# Altium schematic sheet Alimentacion_Sheet.SchDoc: Alimentacion
size 381 x 241 mm; Date: 13-10-2025; Author: Gerson T.& Lotfi D.; DrawnBy: NPI; Organization: Universidad Distrital Francisco José de Caldas; DocumentNumber: 2; Revision: 1.0; SheetNumber: 2; SheetTotal: 5; Time: 13:44
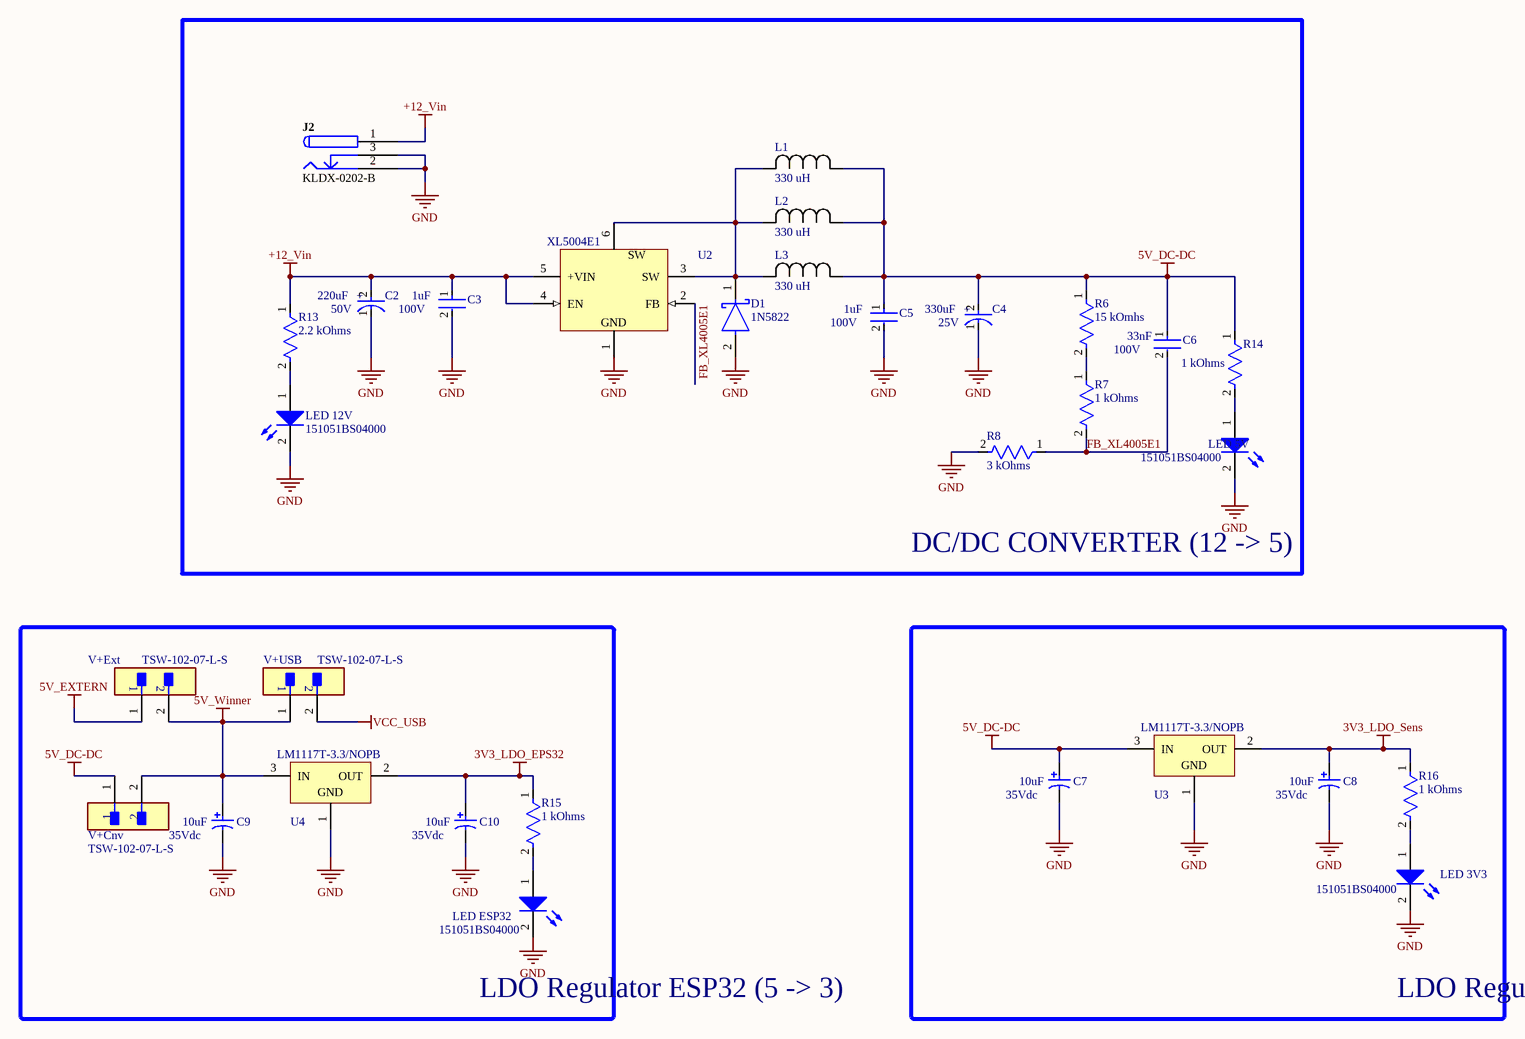
[diagram p0: Alimentacion_Sheet.SchDoc]

## Parts
C2  Voltage Rating: 50V  Capacitance: 220uF  [FP-RAD-TH-D_10_0_5-L_16_1-MFG]  (hidden comment: EEUFR1H221B)
C3  Voltage Rating: 100V  Capacitance: 1uF  [FP-RCE2A2-MFG]  (hidden comment: RCER72A105K2A2H03B)
C4  Voltage Rating (DC): 25V  Capacitance: 330uF  [FP-RAD-TH-D_8_0_5-L_11_5-MFG]  (hidden comment: EEUHD1E331)
C5  Voltage Rating: 100V  Capacitance: 1uF  [FP-RCE2A2-MFG]  (hidden comment: RCER72A105K2A2H03B)
C6  Voltage Rating: 100V  Capacitance: 33nF  [FP-RCE1K1-2_5-MFG]  (hidden comment: RCER72A333K1M1H03A)
C7  Voltage: 35Vdc  Capacitance Value: 10uF  [KEMT-T352_E_V]  (hidden comment: T352E475K035AT)
C8  Voltage: 35Vdc  Capacitance Value: 10uF  [KEMT-T352_E_V]  (hidden comment: T352E475K035AT)
C9  Voltage: 35Vdc  Capacitance Value: 10uF  [KEMT-T352_E_V]  (hidden comment: T352E475K035AT)
C10  Voltage: 35Vdc  Capacitance Value: 10uF  [KEMT-T352_E_V]  (hidden comment: T352E475K035AT)
D1  1N5822  [FP-DO-201AD-MFG]
J2  KLDX-0202-B  [KYCN-KLDX-0202-B_V]
L1  330 uH  [IND_BOURNS_RLB0608]
L2  330 uH  [IND_BOURNS_RLB0608]
L3  330 uH  [IND_BOURNS_RLB0608]
LED_3V3  151051BS04000  [WL-TMRC_D5.9H8.7]
LED_5V  151051BS04000  [WL-TMRC_D5.9H8.7]
LED_12V  151051BS04000  [WL-TMRC_D5.9H8.7]
LED_ESP32  151051BS04000  [WL-TMRC_D5.9H8.7]
R6  15 kOmhs  [FP-FMP100-MFG]
R7  1 kOhms  [FP-FMP100-MFG]
R8  3 kOhms  [FP-FMP100-MFG]
R13  2.2 kOhms  [FP-FMP100-MFG]
R14  1 kOhms  [FP-FMP100-MFG]
R15  1 kOhms  [FP-FMP100-MFG]
R16  1 kOhms  [FP-FMP100-MFG]
U2  XL5004E1  [RO263-5L]
U3  LM1117T-3.3/NOPB  [NDE0003A]
U4  LM1117T-3.3/NOPB  [NDE0003A]
V+Cnv  TSW-102-07-L-S  [FP-TSW-102-07-L-S-MFG]
V+Ext  TSW-102-07-L-S  [FP-TSW-102-07-L-S-MFG]
V+USB  TSW-102-07-L-S  [FP-TSW-102-07-L-S-MFG]

## Blocks framed on the sheet
DC/DC CONVERTER (12 -> 5): C2-C6 D1 J2 L1-L3 LED_5V LED_12V R6-R8 R13 R14 U2
LDO Regulator ESP32 (5 -> 3): C9 C10 LED_ESP32 R15 U4 V+Cnv V+Ext V+USB
LDO Regulator Sensors (5 ->3): C7 C8 LED_3V3 R16 U3

## Nets
3V3_LDO_EPS32: C10.1 R15.1 U4.2(OUT)
3V3_LDO_Sens: C8.1 R16.1 U3.2(OUT)
5V_DC-DC: C4.2(A) C5.1 C6.1 C7.1 L1.1 L2.1 L3.1 R6.1 R14.1 U3.3(IN) V+Cnv.1
5V_EXTERN: V+Ext.1
5V_Winner: C9.1 U4.3(IN) V+Cnv.2 V+Ext.2 V+USB.1
+12_Vin: C2.2(A) C3.1 J2.1 R13.1 U2.4(EN) U2.5(+VIN)
GND: C2.1(C) C3.2 C4.1(C) C5.2 C7.2 C8.2 C9.2 C10.2 D1.2(A) J2.2 J2.3 LED_3V3.2(K) LED_5V.2(K) LED_12V.2(K) LED_ESP32.2(K) R8.2 U2.1(GND) U3.1(GND) U4.1(GND)
VCC_USB: V+USB.2
FB_XL4005E1: C6.2 R7.2 R8.1 U2.2(FB)
NetD1_1: D1.1(C) L1.2 L2.2 L3.2 U2.3(SW) U2.6(SW)
NetLED_3V3_1: LED_3V3.1(A) R16.2
NetLED_5V_1: LED_5V.1(A) R14.2
NetLED_12V_1: LED_12V.1(A) R13.2
NetLED_ESP32_1: LED_ESP32.1(A) R15.2
NetR6_2: R6.2 R7.1

## Notes on the sheet
- (in symbol CMP-05427-000403-1) +
- (in symbol CMP-05427-001780-1) +

## Library data of the parts
C2 = CMP-05427-000403-1: Aluminum Electrolytic Capacitors (Radial Lead Type) 220uF ±20% 50V; ESR (Equivalent Series Resistance): 30mR; Ripple Current: 1.65A; Lead Diameter: 0.6mm; Life (Hours): 8000Hour; Height: 16mm; Min Operating Temperature: -40°C; Lead Pitch: 5mm; Diameter: 10mm; Features: General Purpose; Tolerance: 20%; Mount: Through Hole; Number of Pins: 2; Series: FR; Max Operating Temperature: 105°C; Contact Plating: Tin; Impedance: 30mR; Length: 16mm; Package Quantity: 1; RoHS Compliant: Yes; Lead Free: Lead Free; Packaging: Ammo Pack; Radiation Hardening: No; Termination: Radial; Voltage Rating (DC): 50V; Case/Package: Radial; REACH SVHC: No SVHC; Height - Seated (Max): 0.689inch
C3 C5 = CMP-06035-004838-1: Cap Ceramic 1uF 100V X7R ±10% Radial 2.5mm +125°C Automotive Bulk; Lead Diameter: 0.5mm; Lead/Base Style: Straight; Height: 4mm; Tolerance: 10%; Ratings: AEC-Q200; Packaging: Bulk; Max Operating Temperature: 125°C; Package Quantity: 500; Case/Package: Radial; Min Operating Temperature: -55°C; Resistor Type: Ceramic; Lead Pitch: 0.098inch; Height - Seated (Max): 0.157inch; Length: 0.217inch; Width: 0.124inch; Termination: Radial; Mount: Through Hole; Dielectric: X7R; Voltage Rating (DC): 100V
C4 = CMP-05427-001780-1: Aluminum Electrolytic Capacitors (Radial Lead Type) AEC-Q200 Qualified 330uF ±20% 25V; Lead/Base Style: Straight; Lead Diameter: 0.6mm; Polarity: Polar; Ripple Current (AC): 310mA; Life (Hours): 1000Hour; Termination: Radial; Construction: RADIAL; Diameter: 8mm; Tolerance: 20%; Series: Automotive, AEC-Q200, HD; Min Operating Temperature: -55°C; REACH SVHC: No SVHC; Length: 11.5mm; Case/Package: Radial; RoHS Compliant: Yes; Voltage: 25V; Packaging: Bulk; Height - Seated (Max): 0.512inch; Ripple Current: 310mA; Number of Pins: 2; Max Operating Temperature: 105°C; Voltage Rating: 25V; Lead Pitch: 3.5mm; Package Quantity: 200; Mount: Through Hole; Height: 11.5mm
C6 = CMP-06035-020669-1: Cap Ceramic Monolithic 33nF 100V 10% Thru-Hole Bulk; Lead Diameter: 0.5mm; Lead/Base Style: Formed Leads; Dielectric: X7R; Height: 3.5mm; Height - Seated (Max): 0.138inch; Ratings: AEC-Q200; Mount: Through Hole; Length: 0.157inch; Max Operating Temperature: 125°C; Lead Pitch: 0.197inch; Resistor Type: Ceramic; Termination: Radial; Package Quantity: 2000; Width: 0.098inch; Packaging: Tape and Reel; Case/Package: Radial; Tolerance: 10%; Min Operating Temperature: -55°C; Voltage Rating (DC): 100V
C7-C10 = CMP-2000-07185-1: Capacitor, Tantalum, Radial, Solid Tantalum, Conformal, Dipped, 4.7 uF, +/- 10%, 35 V, -55 to 125 degC, 2-Pin THD (T352), RoHS, Bulk; Manufacturer: KEMET; Product Height: 11.7(Max)mm; Lead Pitch For Radial: 5.08mm; Product Diameter: 5.5(Max)mm; Voltage Rating DC: 35V; Package Description: 2-Pin Through Hole Device, Body 5.5 x 0.5 mm, Height 11.7 mm; Manufacturer URL: http://www.kemet.com/; Operating Temperature: -55to125°C; Packaging: Bulk; Category: CapacitorTantalumSolidRadial; Case Style: Dipped; PartNumber: T352E475K035AT; Maximum Operating Temperature: 125°C; Tolerance: 10%; Minimum Operating Temperature: -55°C; Mounting Technology: ThroughHole; Package Reference: T352; Datasheet Version: 05/2016; Datasheet URL: http://capacitoredge.kemet.com/capedge2/DataSheet/Datasheet-T352E475K035AT.pdf?pn=T352E475K035AT; Package URL: http://capacitoredge.kemet.com/capedge2/DataSheet/Datasheet-T352E475K035AT.pdf?pn=T352E475K035AT
D1 = CMP-12187-000025-1: DIODE SCHOTTKY 40V 3A DO201AD; Manufacturer: STMicroelectronics; Max Junction Temp: +150°C; Peak Reverse Current: 2mA; Max Surge Forward Current: 80A; Temperature Range High: +150°C; Automotive: No; RoHS: TRUE; ComponentLink2Description: Datasheet; Manufacturer Part Number: 1N5822; Lead Free: Yes; Octopart: https://octopart.com/1n5822-stmicroelectronics-323225; Device Class L2: Diodes; Max Repetitive Reverse Voltage: 40V; Temperature: to +150°C; Height: 5.3mm; Category: Diode; Digikey Description: DIODE SCHOTTKY 40V 3A DO201AD; ComponentLink2URL: https://www.st.com/resource/en/datasheet/1n5822.pdf; Device Class L3: Schottky Diodes; Device Class L1: Discrete Semiconductors; Forward Current: 3A; Mouser Description: Schottky Diodes & Rectifiers Vr/40V Io/3A BULK; Package: DO-201AD
J2 = CMP-0256-00001-1: 3 Conductor Power Jack, 2 break 2 aux contacts; ComponentLink2URL: http://anacapa.kycon.com/Catalog_PDF/KLDX_0202.pdf; PackageReference: KLDX-0202-B; Contact Finish: Brass; ComponentLink2Description: Datasheet; Mounting Technology: Through Hole; PackageDescription: Jack, 9 x 14.5 mm Body, 2.5 mm Center Pin Diameter; ComponentLink1Description: Manufacturer URL; PartNumber: KLDX-0202-B; ComponentLink1URL: http://kycon.com/
L1-L3 = RLB0608-1R8ML: No Description Available; Manufacturer_Name: Bourns Electronics; Copyright: Copyright (C) 2025 Ultra Librarian. All rights reserved.; Manufacturer_Part_Number: RLB0608-1R8ML
LED_3V3 LED_5V LED_12V LED_ESP32 = CMP-1488-00009-2: NexarPartId: 29717812; Test Current: 20mA; Forward Voltage: 3.2V; Wavelength: 470nm; Lens Size: 5mm; Lens Style: Circular, Diffused, Round; Forward Current: 100mA; Peak Wavelength: 465nm; Viewing Angle: 40°; Luminous Intensity: 500mcd; Max Reverse Voltage (DC): 5V; Case/Package: Radial; Width: 5mm; Mount: Through Hole; Min Operating Temperature: -40°C; Length: 5mm; Height: 8.6mm; Max Operating Temperature: 85°C; Packaging: Bulk; Color: Blue; RoHS: Compliant; REACH SVHC: Unknown; Dominant Wavelength: 470nm
R6-R8 R13-R16 = CMP-00621-25629781-1: Resistor, 1 kOhm, ± 5%, 1 W, Axial Leaded, Metal Film, High Power Flame Proof; Power Rating: 1W; Resistance: 1kΩ; Temperature Coefficient: 100ppm/°C; Length: 6.3mm; Min Operating Temperature: -55°C; Tolerance: 5%; RoHS: Compliant; Military Standard: Not; Mount: Through Hole; Case/Package: Conformal; Diameter: 2.4mm; Schedule B: 8533210090, 8533210090; Radiation Hardening: No; Lead Free: Lead Free; Composition: Metal Film; Max Operating Temperature: 155°C; Termination: Axial
U2 = XL5004E1: Input Voltage Range: Wide 5V to 32V; Output Adjustable: from 0.8V to 30V; Maximum Duty Cycle: 100%; Minimum Drop Out: 0.6V; Output Current Capability: 5A Constant; Feedback Voltage: 0.776 - 0.824 (typ 0.8) V; Efficiency: 90 %; Shutdown Supply Current: 60 - 200 uA; Quiescent Supply Current: 3 - 5 mA; Switch Current Limit: 8 A; Switching Frequency: Fixed 300KHz; ComponentLink1Description: Suplier; ComponentLink1URL: https://www.lcsc.com/product-detail/C73332.html?s_z=n_xl4005; ComponentLink2Description: datasheet (1); ComponentLink2URL: https://www.lcsc.com/datasheet/C73332.pdf; ComponentLink3Description: datasheet (2); ComponentLink3URL: https://www.sigmaelectronica.net/wp-content/uploads/2022/11/XL4005-XLSEMI.pdf; ComponentLink4Description: datasheet (3); ComponentLink4URL: https://www.alldatasheet.es/datasheet-pdf/view/763182/ETC2/XL4005E1.html
U3 U4 = CMP-0062-02494-3: 800mA Low-Dropout Linear Regulator, 3-pin TO-220, Pb-Free; Manufacturer: Texas Instruments; PackageTopMarking: NSUZXYTTE#*LM1117T*3.3; PowerWise: N; CompType: LDO IC; RoHS: Y; ComponentLink1URL: http://www.ti.com/general/docs/lit/getliterature.tsp?genericPartNumber=LM1117-N&fileType=pdf; PackageReference: NDE0003A; PinCount: 3; ComponentLink1Description: Datasheet URL; PackageDescription: TO-220, Molded, 3 Lead, Straight
V+Cnv V+Ext V+USB = CMP-02766-001428-1: CONN HEADER VERT 2POS 2.54MM; Voltage Rating: 550V; Current Rating: 7.6A; Gender: Male; Number of Contacts: 2; Connector Type: Male Pin; Radiation Hardening: No; Orientation: Straight; Contact Plating: Gold; Max Operating Temperature: 125°C; Mount: Through Hole; Package Quantity: 1; Number of Rows: 1; Housing Material: Polyester; RoHS Compliant: Yes; Length: 5.08mm; Max Voltage Rating (AC): 550V; Pitch: 2.54mm; Packaging: Bulk; Depth: 2.54mm; Termination: Solder; Min Operating Temperature: -55°C; Housing Color: Black; Lead Free: Lead Free; Color: Black; Number of Positions: 2; Width: 2.54mm; Max Current Rating: 7.6A; REACH SVHC: No SVHC; Contact Material: Bronze; Contact Mating Length: 0.23inch; Series: TSW; Contact Type: Male Pin